# Altium schematic sheet WS2812.SchDoc
size A4
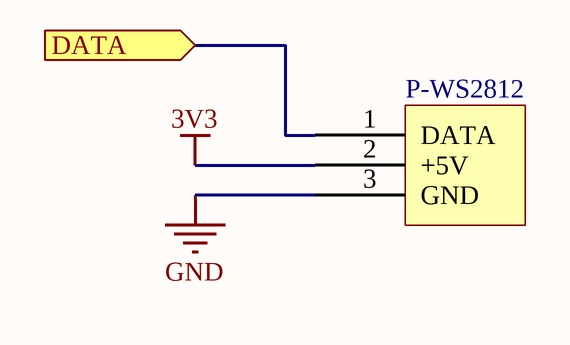
[diagram p0: WS2812.SchDoc]

## Parts
P-WS2812  Addressable LED Strip Connector  [LED strip 3 pads]  (value not drawn)

## Ports
DATA (in)

## Nets
3V3: P-WS2812.2(+5V)
GND: P-WS2812.3(GND)
DATA: P-WS2812.1(DATA) ; port DATA

## Library data of the parts
P-WS2812 = LED strip WS2812